# EAGLE design FAL6567 (EAGLE 7.2.0)
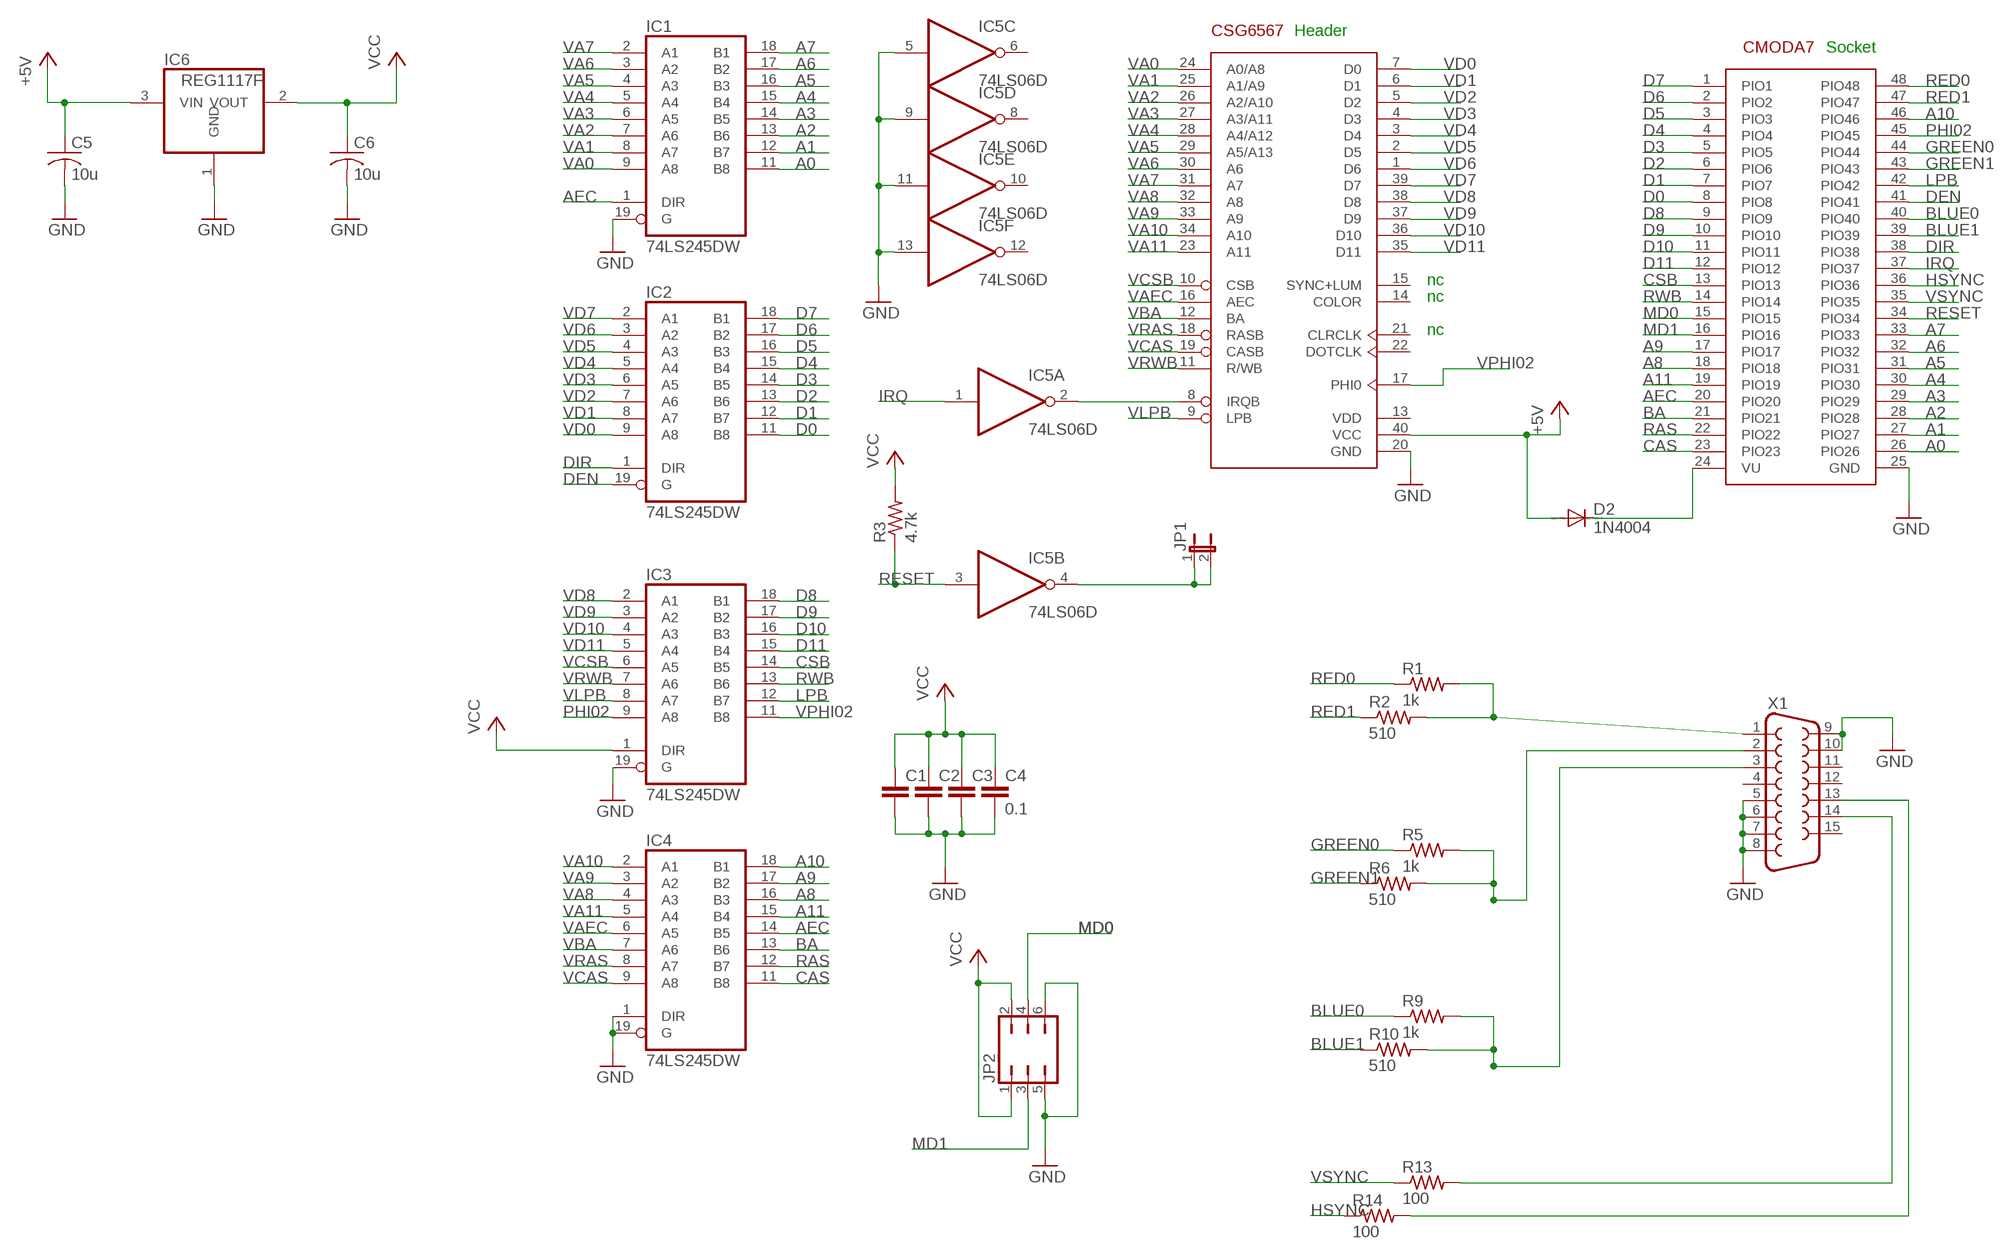
[diagram p0: schematic, sheet 1]

## Parts
C1  C-EU050-024X044  [C050-024X044]
C2  C-EU050-024X044  [C050-024X044]
C3  C-EU050-024X044  [C050-024X044]
C4  0.1  C-EU050-024X044  [C050-024X044]
C5  10u  C-USC1206  [C1206]
C6  10u  C-USC1206  [C1206]
D2  1N4004  [DO41-10]
IC1  74LS245DW  [SO20W]
IC2  74LS245DW  [SO20W]
IC3  74LS245DW  [SO20W]
IC4  74LS245DW  [SO20W]
IC5  74LS06D  [SO14]
IC6  REG1117F  [DD-3]
JP1  JP1E  [JP1]
JP2  JP3Q  [JP3Q]
R1  1k  R-US_0204/7  [0204/7]
R2  510  R-US_0204/7  [0204/7]
R3  4.7k  R-US_0204/7  [0204/7]
R5  1k  R-US_0204/7  [0204/7]
R6  510  R-US_0204/7  [0204/7]
R9  1k  R-US_0204/7  [0204/7]
R10  510  R-US_0204/7  [0204/7]
R13  100  R-US_0204/7  [0204/7]
R14  100  R-US_0204/7  [0204/7]
U$1  CSG6567  [DIP-40]
U$2  CMODA7  [DIL48]
X1  F15HDV  [HDF15V]

## Nets
+5V: C5.1 D2.A IC6.3(VIN) U$1.40(VCC)
A0: IC1.11(B8) U$2.26(PIO26)
A1: IC1.12(B7) U$2.27(PIO27)
A2: IC1.13(B6) U$2.28(PIO28)
A3: IC1.14(B5) U$2.29(PIO29)
A4: IC1.15(B4) U$2.30(PIO30)
A5: IC1.16(B3) U$2.31(PIO31)
A6: IC1.17(B2) U$2.32(PIO32)
A7: IC1.18(B1) U$2.33(PIO33)
A8: IC4.16(B3) U$2.18(PIO18)
A9: IC4.17(B2) U$2.17(PIO17)
A10: IC4.18(B1) U$2.46(PIO46)
A11: IC4.15(B4) U$2.19(PIO19)
AEC: IC1.1(DIR) IC4.14(B5) U$2.20(PIO20)
BA: IC4.13(B6) U$2.21(PIO21)
BLUE0: R9.1 U$2.40(PIO40)
BLUE1: R10.1 U$2.39(PIO39)
CAS: IC4.11(B8) U$2.23(PIO23)
CSB: IC3.14(B5) U$2.13(PIO13)
D0: IC2.11(B8) U$2.8(PIO8)
D1: IC2.12(B7) U$2.7(PIO7)
D2: IC2.13(B6) U$2.6(PIO6)
D3: IC2.14(B5) U$2.5(PIO5)
D4: IC2.15(B4) U$2.4(PIO4)
D5: IC2.16(B3) U$2.3(PIO3)
D6: IC2.17(B2) U$2.2(PIO2)
D7: IC2.18(B1) U$2.1(PIO1)
D8: IC3.18(B1) U$2.9(PIO9)
D9: IC3.17(B2) U$2.10(PIO10)
D10: IC3.16(B3) U$2.11(PIO11)
D11: IC3.15(B4) U$2.12(PIO12)
DEN: IC2.19(G) U$2.41(PIO41)
DIR: IC2.1(DIR) U$2.38(PIO38)
GND: C1.2 C2.2 C3.2 C4.2 C5.2 C6.2 IC1.19(G) IC3.19(G) IC4.1(DIR) IC4.19(G) IC5.5(C:I) IC5.9(D:I) IC5.11(E:I) IC5.13(F:I) IC6.1(GND) JP2.5 JP2.6 U$1.20(GND) U$2.25(GND) X1.5 X1.6 X1.7 X1.8 X1.9 X1.10
GREEN0: R5.1 U$2.44(PIO44)
GREEN1: R6.1 U$2.43(PIO43)
HSYNC: R14.1 U$2.36(PIO36)
IRQ: IC5.1(A:I) U$2.37(PIO37)
LPB: IC3.12(B7) U$2.42(PIO42)
MD0: JP2.4 U$2.15(PIO15)
MD1: JP2.3 U$2.16(PIO16)
N$1: IC5.2(A:O) U$1.8(IRQB)
N$4: D2.C U$2.24(VU)
N$7: R1.2 R2.2 X1.1
N$8: IC5.4(B:O) JP1.1 JP1.2
N$10: R9.2 R10.2 X1.3
N$12: R14.2 X1.13
N$13: R13.2 X1.14
N$15: R5.2 R6.2 X1.2
PHI02: IC3.9(A8) U$2.45(PIO45)
RAS: IC4.12(B7) U$2.22(PIO22)
RED0: R1.1 U$2.48(PIO48)
RED1: R2.1 U$2.47(PIO47)
RESET: IC5.3(B:I) R3.1 U$2.34(PIO34)
RWB: IC3.13(B6) U$2.14(PIO14)
VA0: IC1.9(A8) U$1.24(A0/A8)
VA1: IC1.8(A7) U$1.25(A1/A9)
VA2: IC1.7(A6) U$1.26(A2/A10)
VA3: IC1.6(A5) U$1.27(A3/A11)
VA4: IC1.5(A4) U$1.28(A4/A12)
VA5: IC1.4(A3) U$1.29(A5/A13)
VA6: IC1.3(A2) U$1.30(A6)
VA7: IC1.2(A1) U$1.31(A7)
VA8: IC4.4(A3) U$1.32(A8)
VA9: IC4.3(A2) U$1.33(A9)
VA10: IC4.2(A1) U$1.34(A10)
VA11: IC4.5(A4) U$1.23(A11)
VAEC: IC4.6(A5) U$1.16(AEC)
VBA: IC4.7(A6) U$1.12(BA)
VCAS: IC4.9(A8) U$1.19(CASB)
VCC: C1.1 C2.1 C3.1 C4.1 C6.1 IC3.1(DIR) IC6.2(VOUT) JP2.1 JP2.2 R3.2
VCSB: IC3.6(A5) U$1.10(CSB)
VD0: IC2.9(A8) U$1.7(D0)
VD1: IC2.8(A7) U$1.6(D1)
VD2: IC2.7(A6) U$1.5(D2)
VD3: IC2.6(A5) U$1.4(D3)
VD4: IC2.5(A4) U$1.3(D4)
VD5: IC2.4(A3) U$1.2(D5)
VD6: IC2.3(A2) U$1.1(D6)
VD7: IC2.2(A1) U$1.39(D7)
VD8: IC3.2(A1) U$1.38(D8)
VD9: IC3.3(A2) U$1.37(D9)
VD10: IC3.4(A3) U$1.36(D10)
VD11: IC3.5(A4) U$1.35(D11)
VLPB: IC3.8(A7) U$1.9(LPB)
VPHI02: IC3.11(B8) U$1.17(PHI0)
VRAS: IC4.8(A7) U$1.18(RASB)
VRWB: IC3.7(A6) U$1.11(R/WB)
VSYNC: R13.1 U$2.35(PIO35)
Unconnected: IC5.6(C:O) IC5.8(D:O) IC5.10(E:O) IC5.12(F:O) U$1.14(COLOR) U$1.15(SYNC+LUM) U$1.21(CLRCLK) U$1.22(DOTCLK) X1.4 X1.11 X1.12 X1.15

## Notes on the sheet
- Header
- Socket
- nc
- nc
- nc

## Power pins joined to a net without a drawn wire
GND: IC1.10(GND) IC2.10(GND) IC3.10(GND) IC4.10(GND) IC5.7(P:GND)
VCC: IC1.20(VCC) IC2.20(VCC) IC3.20(VCC) IC4.20(VCC) IC5.14(P:VCC)
VDD: U$1.13(VDD)

## Library data of the parts
C1-C4 = resistor:C-EU: CAPACITOR, European symbol
C5 C6 = resistor:C-US: CAPACITOR, American symbol
D2 = diode:1N4004: DIODE general purpose rectifier, 1 A
IC1-IC4 = FT74xx:74*245: Octal BUS TRANSCEIVER, 3-state
IC5 = FT74xx:74*06: Hex INVERTER, open collector high-voltage output
IC6 = burr-brown:REG1117: 800mA and 1A Low Dropout (LDO) Positive Regulator 1.8V, 2.5V, 2.85V, 3.3V, 5V, and Adj; MF: TEXAS INSTRUMENTS; MPN: REG1117FAKTTT; OC_FARNELL: 1296120; OC_NEWARK: 87H2562
JP1 = jumper:JP1E: JUMPER
JP2 = jumper:JP3Q: JUMPER
R1-R3 R5 R6 R9 R10 R13 R14 = resistor:R-US_: RESISTOR, American symbol
U$1 = 65xxx:CSG6567
U$2 = FT74xx:CMODA7
X1 = con-subd:F15: SUB-D; OC_FARNELL: unknown; OC_NEWARK: unknown

## Board
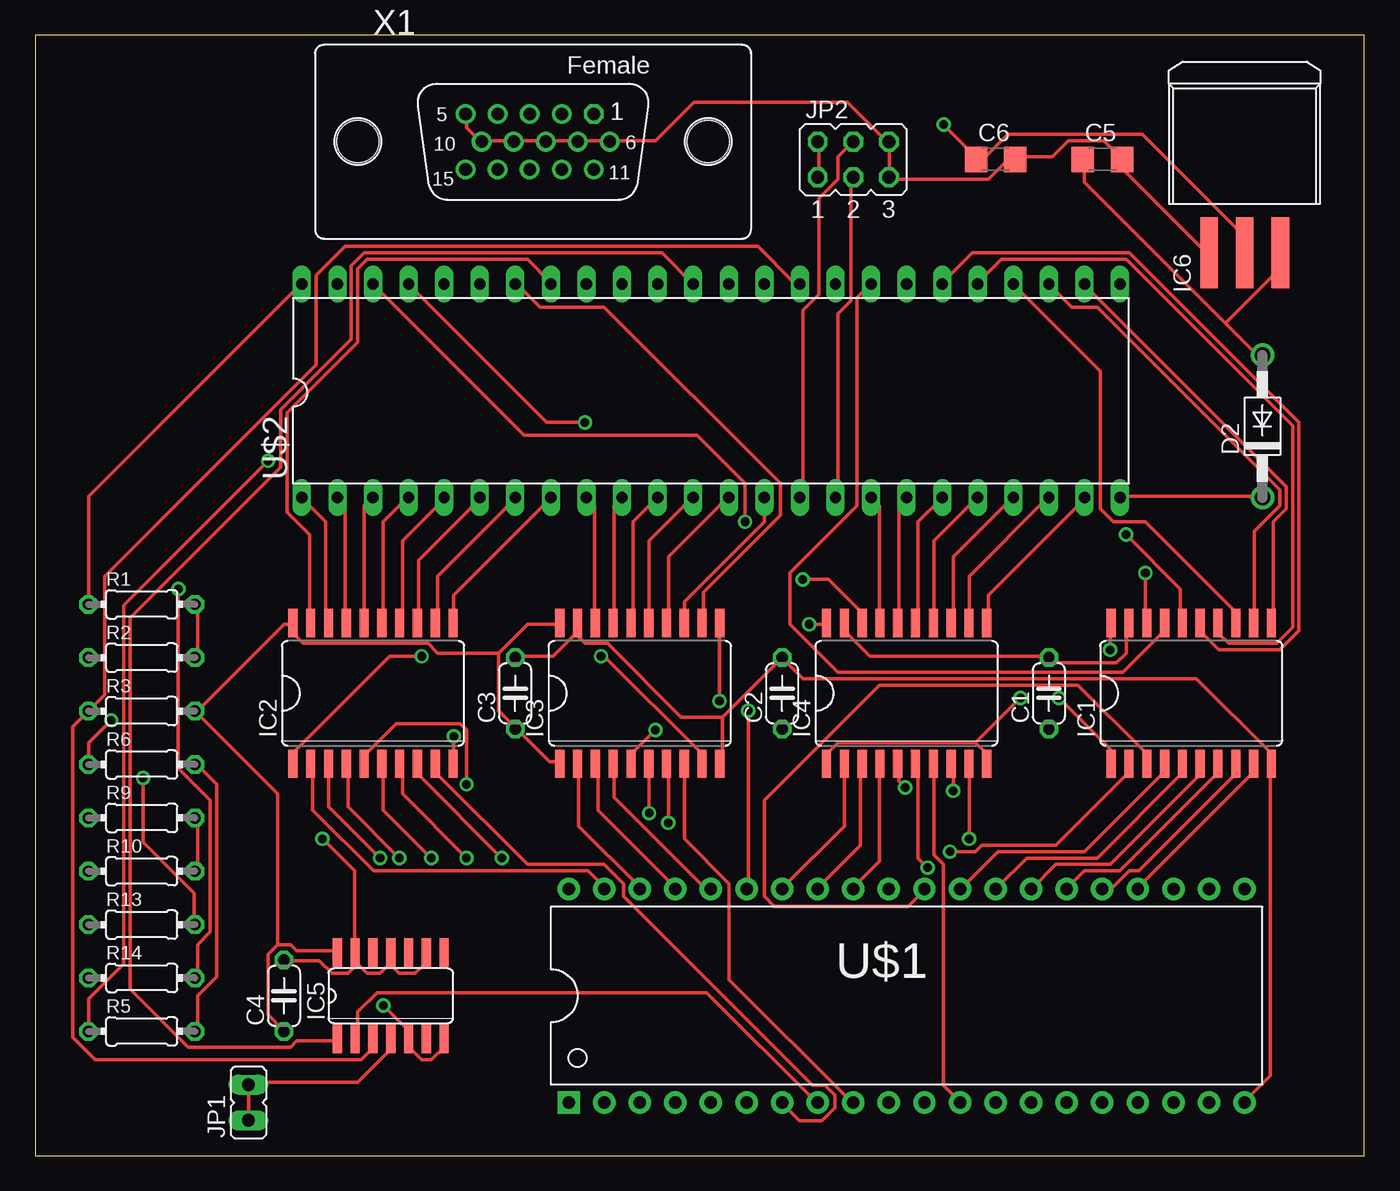
[diagram p1: board, top side]
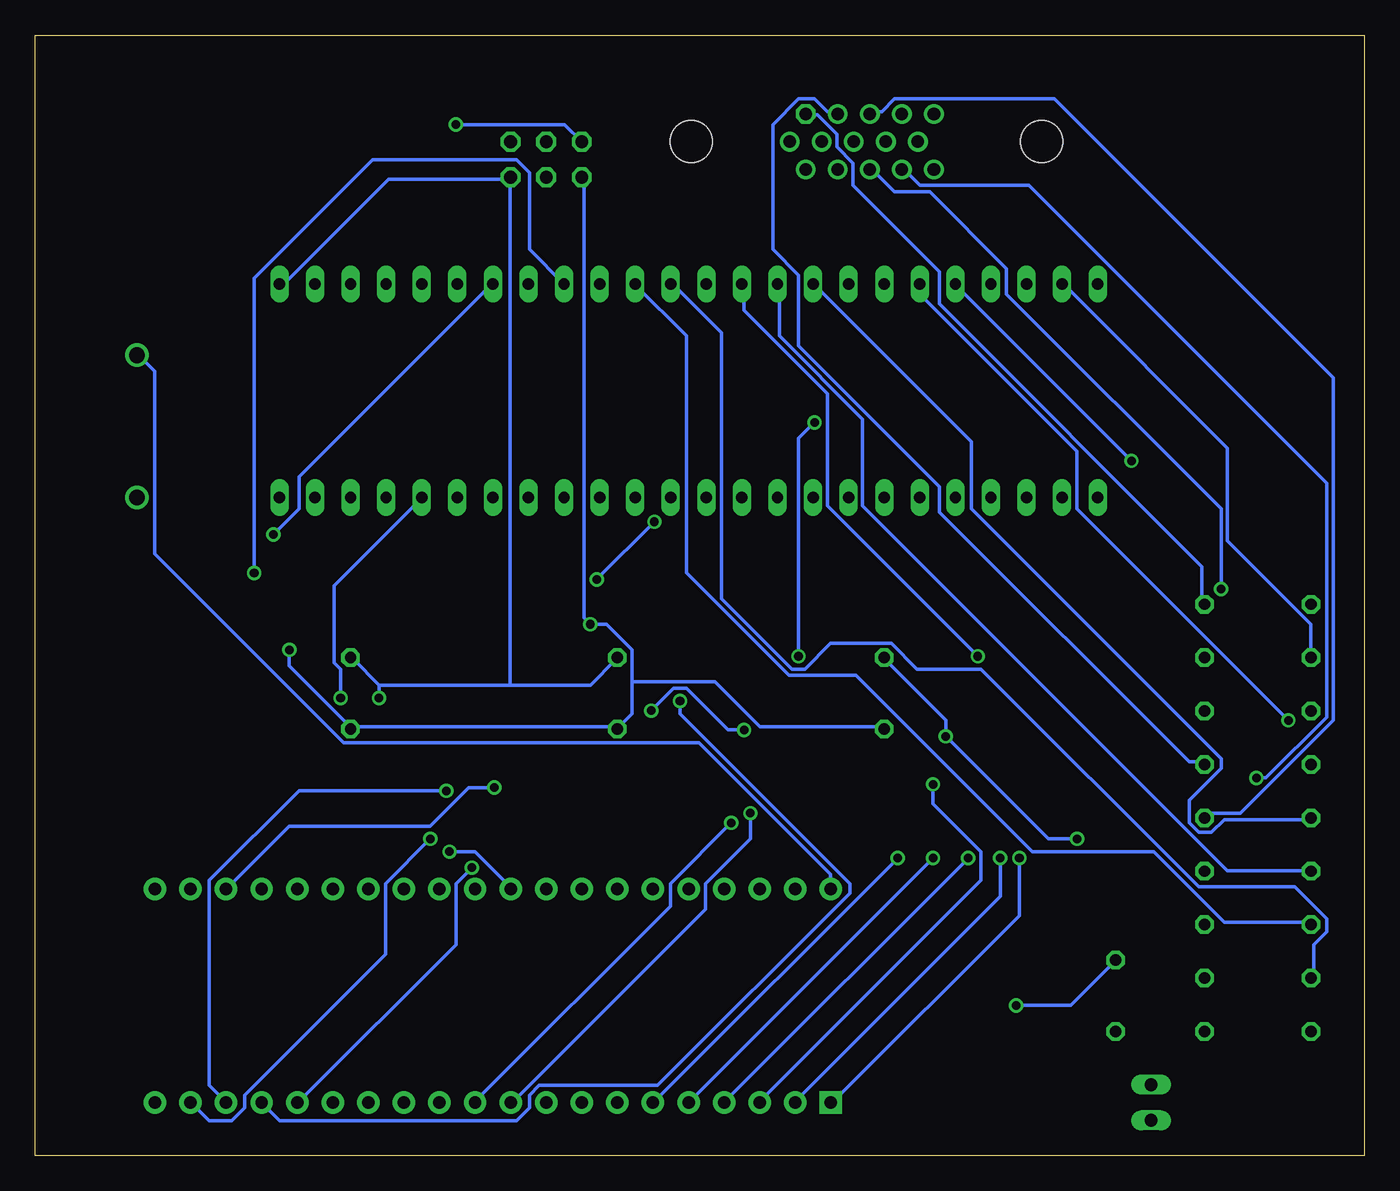
[diagram p2: board, bottom side, seen from below]

Size 94.92 x 80 mm. Coordinates in mm from the lower left corner, seen from the top.
Outline: 0,0 94.92,0 94.92,80 0,80 0,0
Copper layers (1*16): Top 0.035mm / dielectric 1.5mm / Bottom 0.035mm
Design rules "default": minimum track width 10mil, minimum drill 24mil, track to track 8mil, track to pad 8mil, pad to pad 8mil, via to via 8mil, smd to smd 8mil, copper to edge 40mil, drill to drill 8mil, minimum pad ring 10mil, minimum via ring 8mil, stop-mask expansion 4mil, vias tented up to drill 0mil, thermal gap 10mil

### Footprints (pad centres in the part's own frame; a part is rotated, then mirrored left to right if it is on the bottom)
C050-024X044 = drill 0.813 octagon: 1 -2.54,0; 2 2.54,0
C1206 = smd 1.6 x 1.8: 1 -1.4,0; 2 1.4,0
DO41-10 = drill 1.118: A 5.08,0; C -5.08,0
SO20W = smd 0.66 x 2.032: 1 -5.715,-5.029; 2 -4.445,-5.029; 3 -3.175,-5.029; 4 -1.905,-5.029; 5 -0.635,-5.029; 6 0.635,-5.029; 7 1.905,-5.029; 8 3.175,-5.029; 9 4.445,-5.029; 10 5.715,-5.029; 11 5.715,5.029; 12 4.445,5.029; 13 3.175,5.029; 14 1.905,5.029; 15 0.635,5.029; 16 -0.635,5.029; 17 -1.905,5.029; 18 -3.175,5.029; 19 -4.445,5.029; 20 -5.715,5.029
SO14 = smd 0.66 x 2.032: 1 -3.81,-3.073; 2 -2.54,-3.073; 3 -1.27,-3.073; 4 0,-3.073; 5 1.27,-3.073; 6 2.54,-3.073; 7 3.81,-3.073; 8 3.81,3.073; 9 2.54,3.073; 10 1.27,3.073; 11 0,3.073; 12 -1.27,3.073; 13 -2.54,3.073; 14 -3.81,3.073
DD-3 = smd 1.27 x 5.08: 1 -2.54,-7.938; 2 0,-7.938; 3 2.54,-7.938
JP1 = drill 0.914 long: 1 0,-1.27; 2 0,1.27
JP3Q = drill 0.914 octagon: 1 -2.54,-1.27; 2 -2.54,1.27; 3 0,-1.27; 4 0,1.27; 5 2.54,-1.27; 6 2.54,1.27
0204/7 = drill 0.813 octagon: 1 -3.81,0; 2 3.81,0
DIP-40 = drill 0.889 pad 1.6 square: 1 -22.86,-7.62 | drill 0.889 pad 1.6: 2 -20.32,-7.62; 3 -17.78,-7.62; 4 -15.24,-7.62; 5 -12.7,-7.62; 6 -10.16,-7.62; 7 -7.62,-7.62; 8 -5.08,-7.62; 9 -2.54,-7.62; 10 0,-7.62; 11 2.54,-7.62; 12 5.08,-7.62; 13 7.62,-7.62; 14 10.16,-7.62; 15 12.7,-7.62; 16 15.24,-7.62; 17 17.78,-7.62; 18 20.32,-7.62; 19 22.86,-7.62; 20 25.4,-7.62; 21 25.4,7.62; 22 22.86,7.62; 23 20.32,7.62; 24 17.78,7.62; 25 15.24,7.62; 26 12.7,7.62; 27 10.16,7.62; 28 7.62,7.62; 29 5.08,7.62; 30 2.54,7.62; 31 0,7.62; 32 -2.54,7.62; 33 -5.08,7.62; 34 -7.62,7.62; 35 -10.16,7.62; 36 -12.7,7.62; 37 -15.24,7.62; 38 -17.78,7.62; 39 -20.32,7.62; 40 -22.86,7.62
DIL48 = drill 0.813 long: 1 -29.21,-7.62; 2 -26.67,-7.62; 3 -24.13,-7.62; 4 -21.59,-7.62; 5 -19.05,-7.62; 6 -16.51,-7.62; 7 -13.97,-7.62; 8 -11.43,-7.62; 9 -8.89,-7.62; 10 -6.35,-7.62; 11 -3.81,-7.62; 12 -1.27,-7.62; 13 1.27,-7.62; 14 3.81,-7.62; 15 6.35,-7.62; 16 8.89,-7.62; 17 11.43,-7.62; 18 13.97,-7.62; 19 16.51,-7.62; 20 19.05,-7.62; 21 21.59,-7.62; 22 24.13,-7.62; 23 26.67,-7.62; 24 29.21,-7.62; 25 29.21,7.62; 26 26.67,7.62; 27 24.13,7.62; 28 21.59,7.62; 29 19.05,7.62; 30 16.51,7.62; 31 13.97,7.62; 32 11.43,7.62; 33 8.89,7.62; 34 6.35,7.62; 35 3.81,7.62; 36 1.27,7.62; 37 -1.27,7.62; 38 -3.81,7.62; 39 -6.35,7.62; 40 -8.89,7.62; 41 -11.43,7.62; 42 -13.97,7.62; 43 -16.51,7.62; 44 -19.05,7.62; 45 -21.59,7.62; 46 -24.13,7.62; 47 -26.67,7.62; 48 -29.21,7.62
HDF15V = drill 0.9 octagon: 1 4.329,1.98 | drill 0.9: 2 2.043,1.98; 3 -0.243,1.98; 4 -2.529,1.98; 5 -4.815,1.98; 6 5.472,0; 7 3.186,0; 8 0.9,0; 9 -1.386,0; 10 -3.672,0; 11 4.329,-1.98; 12 2.043,-1.98; 13 -0.243,-1.98; 14 -2.529,-1.98; 15 -4.815,-1.98 | hole 3: -12.5,0; 12.5,0

### Placement (x,y rotation side)
C1  72.39,33.02 90 top
C2  53.34,33.02 90 top
C3  34.29,33.02 90 top
C4  17.78,11.43 90 top
C5  76.2,71.12 0 top
C6  68.58,71.12 0 top
D2  87.63,52.07 90 top
IC1  82.55,33.02 0 top
IC2  24.13,33.02 0 top
IC3  43.18,33.02 0 top
IC4  62.23,33.02 0 top
IC5  25.4,11.43 0 top
IC6  86.36,72.39 0 top
JP1  15.24,3.81 0 top
JP2  58.42,71.12 0 top
R1  7.62,39.37 0 top
R2  7.62,35.56 0 top
R3  7.62,31.75 0 top
R5  7.62,8.89 0 top
R6  7.62,27.94 0 top
R9  7.62,24.13 0 top
R10  7.62,20.32 0 top
R13  7.62,16.51 0 top
R14  7.62,12.7 0 top
U$1  60.96,11.43 0 top
U$2  48.26,54.61 0 top
X1  35.56,72.39 0 top

### Tracks (layer width: path | path; a pad name or v marks a point on that pad's centre or on a via)
+5V
  Top 0.254: 84.99,59.44 87.27,57.15 D2.A | 84.99,59.44 74.93,69.49 74.93,71.09 C5.1 | 84.99,59.44 88.88,63.32 88.88,64.24 IC6.3
  Bottom 0.254: U$1.40 38.12,19.2 38.12,20.12 47.5,29.49 72.87,29.49 86.36,42.98 86.36,56.01 87.5,57.15 D2.A
A0
  Top 0.254: IC1.11 88.42,38.18 88.42,45.26 89.33,46.18 89.33,47.78 74.93,62.18 U$2.26
A1
  Top 0.254: IC1.12 87.05,38.18 87.05,44.58 88.88,46.41 88.88,47.55 75.84,60.58 74.02,60.58 72.42,62.18 U$2.27
A2
  Top 0.254: U$2.28 76.07,56.01 76.07,46.18 76.99,45.26 79.27,45.26 85.67,38.86 85.67,38.18 IC1.13
A3
  Top 0.254: IC1.14 84.53,37.95 84.53,37.26 85.22,36.58 88.65,36.58 89.79,37.72 89.79,52.12 77.9,64.01 68.99,64.01 67.39,62.41 U$2.29
A4
  Top 0.254: IC1.15 83.39,37.95 83.39,37.26 84.53,36.12 88.88,36.12 90.25,37.49 90.25,52.35 78.13,64.47 66.93,64.47 64.87,62.41 U$2.30
A5  (via drill 0.61)
  Top 0.254: v77.9,44.35 81.79,40.46 81.79,38.18 IC1.16
  Bottom 0.254: v77.9,44.35 76.07,46.18 76.07,48.46 62.36,62.18 U$2.31
A6
  Top 0.254: IC1.17 80.64,37.49 77.67,34.52 57.33,34.52 53.9,37.95 53.9,41.6 58.7,46.41 58.7,61.27 59.61,62.18 U$2.32
A7  (via drill 0.61)
  Top 0.254: v79.27,41.6 79.27,38.18 IC1.18
  Bottom 0.254: v79.27,41.6 79.27,62.64 70.81,71.09 60.53,71.09 59.61,70.18 59.61,64.69 U$2.33
A8
  Top 0.254: IC4.16 61.67,38.18 61.67,46.41 62.13,46.86 U$2.18
A9
  Top 0.254: IC4.17 60.3,38.18 60.3,46.41 59.84,46.86 U$2.17
A10  (via drill 0.61)
  Top 0.254: v54.81,41.15 56.64,41.15 58.93,38.86 58.93,38.18 IC4.18 | v50.7,45.26 50.7,48.01 47.27,51.44 34.93,51.44 U$2.46
  Bottom 0.254: v50.7,45.26 v54.81,41.15
A11
  Top 0.254: U$2.19 63.04,45.26 63.04,38.18 IC4.15
AEC  (via drill 0.61)
  Top 0.254: IC4.14 64.19,38.18 64.19,43.89 67.16,46.86 U$2.20 | v73.1,32.69 76.76,29.03 76.76,28.12 IC1.1
  Bottom 0.254: v73.1,32.69 73.1,34.75 73.56,35.2 73.56,40.69 67.39,46.86 U$2.20
BA
  Top 0.254: IC4.13 65.56,38.18 65.56,42.75 69.67,46.86 U$2.21
BLUE0
  Bottom 0.254: R9.1 3.83,24 10.01,24 10.92,23.09 11.84,23.09 12.52,23.77 12.52,25.38 10.24,27.66 10.24,28.35 28.07,46.18 28.07,50.98 39.27,62.18 U$2.40
BLUE1
  Bottom 0.254: R10.1 3.83,20.34 9.78,20.34 35.84,46.41 35.84,52.58 41.78,58.52 41.78,62.18 U$2.39
CAS
  Top 0.254: IC4.11 68.07,38.18 68.07,40.01 74.93,46.86 U$2.23
CSB
  Top 0.254: IC3.14 45.21,38.18 45.21,42.75 49.33,46.86 U$2.13
D0
  Top 0.254: IC2.11 29.9,38.18 29.9,40.01 36.75,46.86 U$2.8
D1
  Top 0.254: IC2.12 28.75,38.18 28.75,41.38 34.24,46.86 U$2.7
D2
  Top 0.254: IC2.13 27.38,38.18 27.38,42.52 31.73,46.86 U$2.6
D3
  Top 0.254: IC2.14 26.24,38.18 26.24,43.89 29.21,46.86 U$2.5
D4
  Top 0.254: IC2.15 24.87,38.18 24.87,45.26 26.47,46.86 U$2.4
D5
  Top 0.254: IC2.16 23.49,46.41 23.95,46.86 U$2.3
D6
  Top 0.254: IC2.17 22.12,38.18 22.12,46.41 21.67,46.86 U$2.2
D7
  Top 0.254: IC2.18 20.75,38.18 20.75,45.26 19.15,46.86 U$2.1
D8
  Top 0.254: U$2.9 39.95,46.41 39.95,38.18 IC3.18
D9
  Top 0.254: U$2.10 41.33,46.41 41.33,38.18 IC3.17
D10
  Top 0.254: IC3.16 42.7,38.18 42.7,45.26 44.3,46.86 U$2.11
D11
  Top 0.254: IC3.15 43.84,38.18 43.84,43.89 46.81,46.86 U$2.12
DEN
  Top 0.254: IC2.19 19.61,38.18 19.61,44.35 18.01,45.95 18.01,53.03 23.04,58.06 23.04,63.32 23.72,64.01 35.15,64.01 36.75,62.41 U$2.41
DIR  (via drill 0.61)
  Top 0.254: v27.61,35.66 25.32,35.66 18.47,28.8 18.47,28.12 IC2.1
  Bottom 0.254: v27.61,35.66 38.35,46.41 38.35,54.41 44.3,60.35 44.3,62.18 U$2.38
GND  (via drill 0.61)
  Top 0.254: IC6.1 83.62,64.47 77.67,70.41 77.67,71.09 C5.2 77.45,71.32 76.3,72.47 73.79,72.47 72.64,71.32 70.13,71.32 C6.2 69.9,71.09 69.44,71.09 68.07,69.72 60.98,69.72 JP2.5 60.98,69.95 60.98,72.24 JP2.6 60.76,72.47 58.01,75.21 47.04,75.21 44.3,72.47 41.1,72.47 X1.6 40.87,72.47 38.81,72.47 X1.7 38.58,72.47 36.52,72.47 X1.8 36.3,72.47 34.24,72.47 X1.9 34.01,72.47 31.95,72.47 X1.10 31.73,72.47 30.81,73.38 30.81,74.3 X1.5 | 67.16,29.49 57.33,29.49 56.64,28.8 56.64,28.12 IC4.1 | 67.16,29.49 67.84,28.8 67.84,28.12 IC4.10 | IC4.19 57.79,37.49 59.61,35.66 72.19,35.66 C1.2 72.42,35.43 72.64,35.2 77.22,35.2 77.9,35.89 77.9,37.95 IC1.19 | v70.36,32.69 67.16,29.49 | U$1.20 86.36,3.89 88.19,5.71 88.19,27.89 IC1.10 88.19,28.12 88.19,28.8 82.93,34.06 54.81,34.06 53.44,35.43 C2.2 49.1,31.32 | IC5.7 29.21,7.77 28.3,6.86 27.61,6.86 26.7,7.77 26.7,8.23 IC5.5 26.47,8.46 26.47,9.14 v24.87,10.74 | 23.04,13.72 23.04,14.4 IC5.13 | 23.04,13.72 23.72,13.03 24.64,13.03 25.32,13.72 | 25.32,13.72 25.32,14.4 IC5.11 25.32,13.72 | 25.32,13.72 26.01,13.03 27.15,13.03 27.84,13.72 27.84,14.4 IC5.9 | 23.04,13.72 22.35,13.03 21.21,13.03 20.3,13.95 17.78,13.95 C4.2 | 23.04,13.72 IC5.13 | 49.1,31.32 49.1,28.12 IC3.10 | v29.9,29.95 29.9,28.12 IC2.10 | 38.58,37.26 38.58,37.95 IC3.19 38.58,37.26 | 38.58,37.26 36.98,35.66 34.47,35.66 C3.2 | 49.1,31.32 46.13,31.32 40.87,36.58 39.27,36.58 38.58,37.26 | v20.52,22.63 22.81,20.34 22.81,14.63 IC5.13
  Bottom 0.254: 60.98,69.72 69.67,69.72 76.99,62.41 77.45,62.41 U$2.25 | 70.36,33.6 v70.36,32.69 | 70.36,33.6 72.19,35.43 C1.2 | v24.87,10.74 20.98,10.74 17.78,13.95 C4.2 | C3.2 34.24,35.43 29.9,31.09 v29.9,29.95 22.58,22.63 v20.52,22.63 | 60.98,33.6 55.27,33.6 53.44,35.43 C2.2 | 60.98,33.6 70.36,33.6 | 60.98,33.6 60.98,69.72 | 60.98,69.72 JP2.5
GREEN0  (via drill 0.61)
  Top 0.254: v16.64,49.61 6.35,39.32 6.35,13.72 3.83,11.2 3.83,8.91 R5.1
  Bottom 0.254: v16.64,49.61 29.21,62.18 U$2.44
GREEN1  (via drill 0.61)
  Top 0.254: v5.44,31.09 3.83,29.49 3.83,28.12 R6.1
  Bottom 0.254: v5.44,31.09 20.52,46.18 20.52,50.29 31.73,61.49 31.73,62.18 U$2.43
HSYNC
  Bottom 0.254: R14.1 3.61,12.8 3.61,15.09 2.69,16 2.69,16.92 4.98,19.2 11.84,19.2 27.38,34.75 31.95,34.75 33.78,36.58 38.12,36.58 39.95,34.75 40.87,34.75 45.9,39.78 45.9,58.75 49.33,62.18 U$2.36
IRQ
  Top 0.254: U$2.37 44.76,64.47 23.49,64.47 22.58,63.55 22.58,58.29 17.55,53.26 17.55,49.15 6.81,38.41 6.81,11.89 10.92,7.77 18.24,7.77 18.69,8.23 21.44,8.23 IC5.1
LPB
  Top 0.254: IC3.12 47.73,38.18 47.73,40.23 53.21,45.72 53.21,48.01 40.64,60.58 36.07,60.58 34.47,62.18 U$2.42
MD0
  Top 0.254: U$2.15 54.81,47.09 54.81,60.35 55.96,61.49 55.96,68.35 57.33,69.72 57.33,71.32 58.24,72.24 JP2.4
MD1
  Top 0.254: U$2.16 57.33,47.09 57.33,60.12 58.24,61.04 58.24,69.72 JP2.3
N$1
  Top 0.254: IC5.2 23.04,8.46 23.04,10.29 24.41,11.66 47.95,11.66 55.73,3.89 U$1.8
N$4
  Top 0.254: U$2.24 77.67,47.09 87.5,47.09 D2.C
N$7
  Top 0.254: R2.2 11.61,35.66 11.61,39.32 R1.2
  Bottom 0.254: X1.1 39.73,74.3 39.04,74.3 37.67,72.92 37.67,72.01 36.52,70.87 36.52,69.27 30.35,63.09 30.35,60.81 11.61,42.06 11.61,39.55 R1.2
N$8
  Top 0.254: IC5.4 25.32,8.23 25.32,7.54 23.04,5.26 15.26,5.26 JP1.2 15.26,5.03 15.26,2.74 JP1.1
N$10
  Top 0.254: R10.2 11.61,20.34 11.61,24 R9.2
  Bottom 0.254: X1.3 35.15,74.52 34.47,74.52 33.55,75.44 22.12,75.44 2.24,55.55 2.24,31.09 8.87,24.46 11.15,24.46 11.38,24.23 R9.2
N$12  (via drill 0.61)
  Top 0.254: v10.24,40.46 10.24,27.66 12.52,25.38 12.52,16 11.61,15.09 11.61,12.8 R14.2
  Bottom 0.254: v10.24,40.46 10.24,46.18 25.55,61.49 25.55,63.32 31.04,68.81 33.55,68.81 35.15,70.41 X1.13
N$13  (via drill 0.61)
  Top 0.254: v7.72,26.98 7.72,22.4 11.38,18.75 11.38,16.69 R13.2
  Bottom 0.254: v7.72,26.98 7.04,26.98 2.69,31.32 2.69,48.01 23.95,69.27 31.73,69.27 32.87,70.41 X1.14
N$15
  Top 0.254: R5.2 11.61,8.91 11.61,11.43 12.98,12.8 12.98,26.52 11.61,27.89 R6.2
  Bottom 0.254: X1.2 37.67,74.52 38.35,74.52 39.27,75.44 40.41,75.44 42.24,73.61 42.24,64.69 40.41,62.87 40.41,57.84 30.35,47.78 30.35,45.95 12.52,28.12 11.61,28.12 R6.2
PHI02  (via drill 0.61)
  Top 0.254: v40.41,35.66 40.64,35.66 47.5,28.8 47.5,28.12 IC3.9 | v39.27,52.35 36.52,52.35 26.7,62.18 U$2.45
  Bottom 0.254: v40.41,35.66 40.41,51.21 v39.27,52.35
RAS
  Top 0.254: IC4.12 66.7,38.18 66.7,41.38 72.19,46.86 U$2.22
RED0
  Top 0.254: R1.1 3.83,39.55 3.83,47.09 18.92,62.18 U$2.48
RED1
  Bottom 0.254: R2.1 3.83,35.66 3.83,37.95 9.78,43.89 9.78,50.52 21.44,62.18 U$2.47
RESET
  Top 0.254: IC5.3 23.95,8.23 23.95,7.54 23.27,6.86 4.29,6.86 2.69,8.46 2.69,30.63 R3.1 4.98,32.92 4.98,41.38 20.07,56.46 20.07,62.87 22.12,64.92 51.61,64.92 54.13,62.41 54.59,62.41 U$2.34
RWB
  Top 0.254: IC3.13 46.36,39.55 52.07,45.26 U$2.14
VA0
  Top 0.254: IC1.9 86.82,27.89 86.82,27.2 78.82,19.2 U$1.24
VA1
  Top 0.254: IC1.8 85.67,27.89 85.67,27.2 78.82,20.34 78.13,20.34 76.99,19.2 76.3,19.2 U$1.25
VA2
  Top 0.254: IC1.7 84.3,27.89 84.3,27.2 77.45,20.34 74.93,20.34 73.79,19.2 U$1.26
VA3
  Top 0.254: U$1.27 72.87,20.8 76.76,20.8 83.16,27.2 83.16,27.89 IC1.6
VA4
  Top 0.254: IC1.5 81.79,27.89 81.79,27.2 75.84,21.26 70.81,21.26 68.76,19.2 U$1.28
VA5
  Top 0.254: IC1.4 80.64,27.43 74.93,21.72 68.76,21.72 66.24,19.2 U$1.29
VA6
  Top 0.254: IC1.3 79.27,28.12 79.27,28.8 74.47,33.6 60.3,33.6 52.07,25.38 52.07,18.52 52.76,17.83 62.36,17.83 63.5,18.97 U$1.30
VA7  (via drill 0.61)
  Top 0.254: v65.33,21.72 67.16,21.72 67.61,22.17 72.87,22.17 77.9,27.2 77.9,27.89 IC1.2
  Bottom 0.254: v65.33,21.72 63.5,21.72 60.98,19.2 U$1.31
VA8
  Top 0.254: IC4.4 60.3,27.89 60.3,21.03 58.47,19.2 U$1.32
VA9
  Top 0.254: IC4.3 58.93,27.89 58.93,22.17 55.96,19.2 U$1.33
VA10
  Top 0.254: IC4.2 57.79,23.55 53.44,19.2 U$1.34
VA11  (via drill 0.61)
  Top 0.254: v62.13,26.29 61.67,26.75 61.67,27.89 IC4.5
  Bottom 0.254: v62.13,26.29 63.96,26.29 66.7,23.55 76.76,23.55 81.1,19.2 U$1.23
VAEC  (via drill 0.61)
  Top 0.254: v63.73,20.57 63.04,21.26 63.04,27.89 IC4.6
  Bottom 0.254: v63.73,20.57 64.87,19.43 64.87,15.09 76.07,3.89 U$1.16
VBA
  Top 0.254: IC4.7 64.19,27.89 64.19,21.49 64.87,20.8 64.87,5.03 66.02,3.89 U$1.12
VCAS  (via drill 0.61)
  Top 0.254: v66.7,22.63 66.7,27.89 IC4.9
  Bottom 0.254: v66.7,22.63 69.9,19.43 69.9,14.4 79.96,4.34 79.96,3.43 80.87,2.52 82.47,2.52 83.62,3.66 U$1.19
VCC  (via drill 0.61)
  Top 0.254: IC3.1 37.44,28.12 36.75,28.12 34.47,30.4 C3.1 34.24,30.63 33.1,31.77 33.1,35.89 | 33.1,35.89 35.15,37.95 37.44,37.95 IC3.20 | 17.32,15.09 18.24,15.09 18.69,14.63 21.44,14.63 IC5.14 | 17.32,15.09 16.64,14.4 16.64,10.06 17.78,8.91 C4.1 | 17.32,15.09 17.32,25.83 11.61,31.55 R3.2 11.61,31.77 17.78,37.95 18.24,37.95 IC2.20 18.47,37.95 18.47,37.26 19.15,36.58 28.07,36.58 28.75,35.89 33.1,35.89 | IC6.2 86.36,65.61 79.05,72.92 69.44,72.92 67.84,71.32 67.39,71.32 C6.1 67.16,71.32 v64.87,73.61 | v76.76,36.12 76.76,37.95 IC1.20 | JP2.1 55.96,69.95 55.96,72.24 JP2.2 | v55.27,37.95 56.41,37.95 IC4.20
  Bottom 0.254: v76.76,36.12 76.76,34.98 72.42,30.63 C1.1 72.19,30.63 53.44,30.63 C2.1 53.21,30.63 52.3,31.55 52.3,33.83 | 52.3,33.83 52.3,36.12 54.13,37.95 v55.27,37.95 55.73,38.41 55.73,69.72 JP2.1 | v64.87,73.61 57.1,73.61 JP2.2 | 52.3,33.83 46.36,33.83 43.16,30.63 34.47,30.63 C3.1
VCSB  (via drill 0.61)
  Top 0.254: v43.84,24.46 43.84,27.89 IC3.6
  Bottom 0.254: v43.84,24.46 43.84,22.63 47.04,19.43 47.04,17.6 60.76,3.89 U$1.10
VD0
  Top 0.254: IC2.9 28.75,27.89 28.75,27.2 35.15,20.8 40.64,20.8 42.01,19.43 42.01,18.52 55.5,5.03 56.41,5.03 57.1,4.34 57.1,3.43 56.19,2.52 54.59,2.52 53.44,3.66 U$1.7
VD1  (via drill 0.61)
  Top 0.254: v33.33,21.26 27.38,27.2 27.38,27.89 IC2.8
  Bottom 0.254: v33.33,21.26 50.7,3.89 U$1.6
VD2  (via drill 0.61)
  Top 0.254: v30.81,21.26 26.24,25.83 26.24,27.89 IC2.7
  Bottom 0.254: U$1.5 v30.81,21.26
VD3  (via drill 0.61)
  Top 0.254: v28.3,21.26 24.87,24.69 24.87,27.89 IC2.6
  Bottom 0.254: v28.3,21.26 45.67,3.89 U$1.4
VD4  (via drill 0.61)
  Top 0.254: IC2.5 23.49,28.57 25.78,30.86 30.35,30.86 30.81,30.4 v30.81,26.52
  Bottom 0.254: v30.81,26.52 30.81,25.15 27.38,21.72 27.38,19.66 43.16,3.89 U$1.3
VD5  (via drill 0.61)
  Top 0.254: v26.01,21.26 22.35,24.92 22.35,27.89 IC2.4
  Bottom 0.254: v26.01,21.26 26.01,18.52 40.64,3.89 U$1.2
VD6  (via drill 0.61)
  Top 0.254: v24.64,21.26 20.98,24.92 20.98,27.89 IC2.3
  Bottom 0.254: v24.64,21.26 24.64,17.14 37.9,3.89 U$1.1
VD7
  Top 0.254: IC2.2 19.84,27.89 19.84,24.69 24.18,20.34 39.5,20.34 40.64,19.2 U$1.39
VD8
  Top 0.254: IC3.2 38.81,27.89 38.81,23.55 43.16,19.2 U$1.38
VD9
  Top 0.254: IC3.3 40.18,27.89 40.18,24.69 45.67,19.2 U$1.37
VD10
  Top 0.254: IC3.4 41.33,27.89 41.33,25.6 47.73,19.2 48.18,19.2 U$1.36
VD11  (via drill 0.61)
  Top 0.254: v44.3,30.4 42.7,28.8 42.7,28.12 IC3.5 | v50.93,31.77 50.93,19.2 U$1.35
  Bottom 0.254: v44.3,30.4 45.44,30.4 48.41,33.38 49.33,33.38 v50.93,31.77
VLPB
  Top 0.254: IC3.8 46.36,22.63 49.55,19.43 49.55,12.57 58.24,3.89 U$1.9
VPHI02  (via drill 0.61)
  Top 0.254: v48.87,32.46 48.87,37.95 IC3.11
  Bottom 0.254: v48.87,32.46 48.87,31.55 36.75,19.43 36.75,18.75 50.47,5.03 58.93,5.03 59.61,4.34 59.61,3.43 60.53,2.52 77.45,2.52 U$1.17
VRAS  (via drill 0.61)
  Top 0.254: v65.56,26.06 65.56,27.89 IC4.8
  Bottom 0.254: v65.56,26.06 76.07,26.06 82.47,19.66 82.47,5.03 81.33,3.89 U$1.18
VRWB  (via drill 0.61)
  Top 0.254: v45.21,23.77 45.21,27.89 IC3.7
  Bottom 0.254: v45.21,23.77 49.55,19.43 49.55,17.83 63.5,3.89 U$1.11
VSYNC
  Bottom 0.254: R13.1 3.83,16.69 10.01,16.69 15.04,21.72 23.72,21.72 36.3,34.29 41.1,34.29 48.41,41.6 48.41,58.52 52.07,62.18 U$2.35